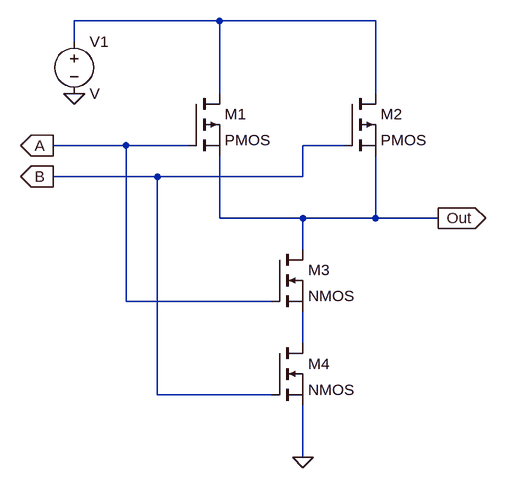
[diagram p0: schematic electronics_cmos_nand.asc]
electronics_cmos_nand.asc, the LTspice schematic file:
Version 4
SHEET 1 880 680
WIRE 128 -16 -96 -16
WIRE 368 -16 128 -16
WIRE -96 16 -96 -16
WIRE 128 96 128 -16
WIRE 368 96 368 -16
WIRE -16 176 -128 176
WIRE 80 176 -16 176
WIRE 320 176 256 176
WIRE 32 224 -128 224
WIRE 256 224 256 176
WIRE 256 224 32 224
WIRE 128 288 128 192
WIRE 256 288 128 288
WIRE 368 288 368 192
WIRE 368 288 256 288
WIRE 464 288 368 288
WIRE 256 336 256 288
WIRE -16 416 -16 176
WIRE 208 416 -16 416
WIRE 256 480 256 432
WIRE 32 560 32 224
WIRE 208 560 32 560
WIRE 256 656 256 576
FLAG 256 656 0
FLAG -96 96 0
FLAG 464 288 Out
IOPIN 464 288 Out
FLAG -128 176 A
IOPIN -128 176 Out
FLAG -128 224 B
IOPIN -128 224 Out
SYMBOL pmos 80 96 R0
SYMATTR InstName M1
SYMBOL pmos 320 96 R0
SYMATTR InstName M2
SYMBOL nmos 208 336 R0
SYMATTR InstName M3
SYMBOL nmos 208 480 R0
SYMATTR InstName M4
SYMBOL voltage -96 0 R0
SYMATTR InstName V1

The netlist it stands for:
* electronics_cmos_nand.asc
M1 N001 A Out Out PMOS
M2 N001 B Out Out PMOS
M3 Out A N002 N002 NMOS
M4 N002 B 0 0 NMOS
V1 N001 0 V
.model NMOS NMOS
.model PMOS PMOS
.lib standard.mos
.backanno
.end